# EAGLE design pressure (EAGLE 6.5.0)
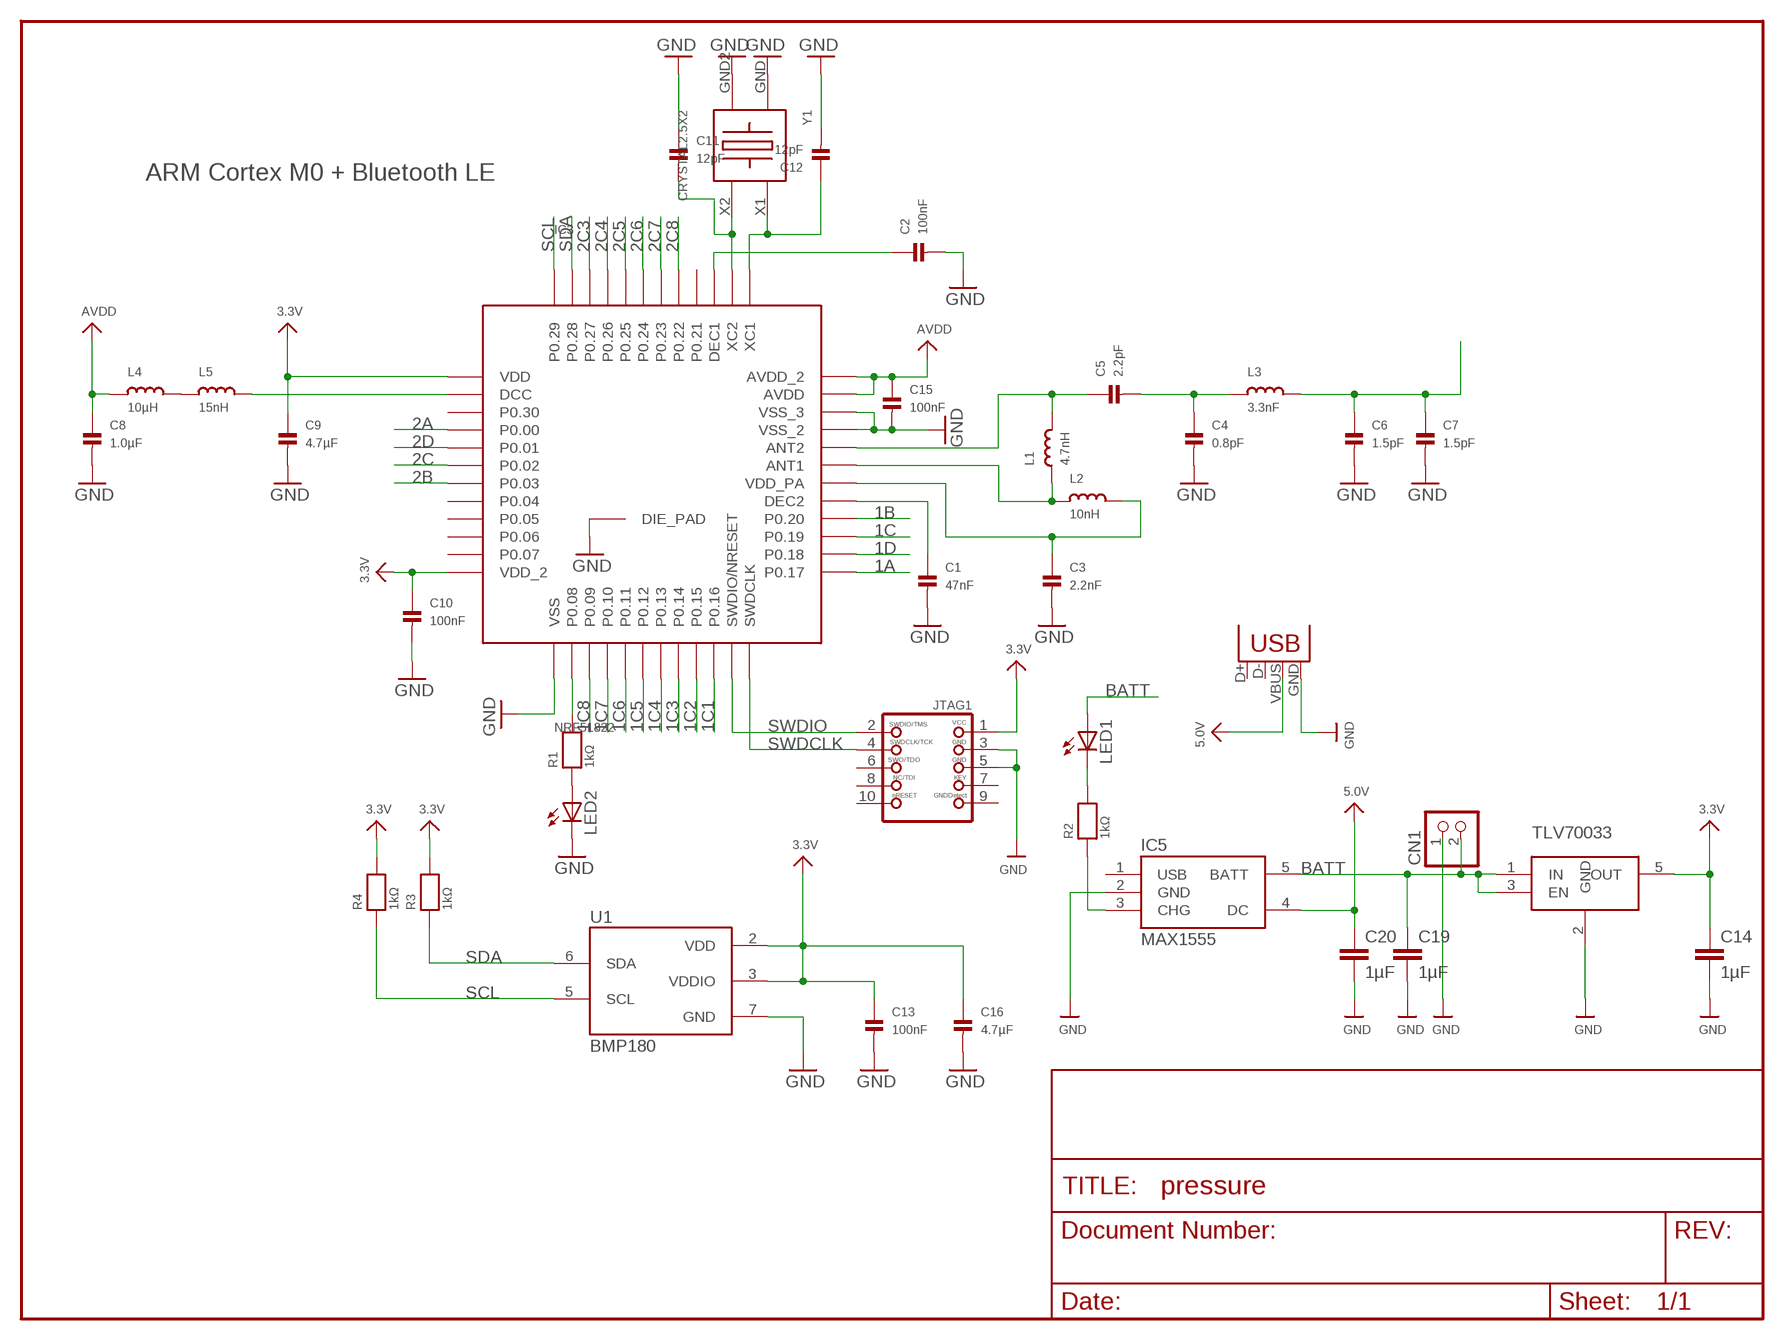
[diagram p0: schematic, sheet 1]

## Parts
C1  47nF  CAP_CERAMIC_0402  [_0402]
C2  100nF  CAP_CERAMIC_0402  [_0402]
C3  2.2nF  CAP_CERAMIC_0402  [_0402]
C4  0.8pF  CAP_CERAMIC_0402  [_0402]
C5  2.2pF  CAP_CERAMIC_0402  [_0402]
C6  1.5pF  CAP_CERAMIC_0402  [_0402]
C7  1.5pF  CAP_CERAMIC_0402  [_0402]
C8  1.0µF  CAP_CERAMIC_0402  [_0402]
C9  4.7µF  CAP_CERAMIC_0402  [_0402]
C10  100nF  CAP_CERAMIC_0402  [_0402]
C11  12pF  CAP_CERAMIC_0402  [_0402]
C12  12pF  CAP_CERAMIC_0402  [_0402]
C13  100nF  CAP_CERAMIC_0402  [_0402]
C14  1µF  C-EUC0603K  [C0603K]
C15  100nF  CAP_CERAMIC_0402  [_0402]
C16  4.7µF  CAP_CERAMIC_0402  [_0402]
C19  1µF  C-EUC0603K  [C0603K]
C20  1µF  C-EUC0603K  [C0603K]
CN1  JST_2PIN  [JSTPH2]
IC3  NRF51822  [QFN48]
IC4  TLV70033DCK  TLV700DCK  [SC70-5L]
IC5  MAX1555  [SOT23-5]
JTAG1  JTAG-CORTEXM3SMT  [2X05_1.27MM_SMT]
L1  4.7nH  INDUCTOR_0402  [_0402]
L2  10nH  INDUCTOR_0402  [_0402]
L3  3.3nF  INDUCTOR_0402  [_0402]
L4  10µH  INDUCTOR_0402  [_0402]
L5  15nH  INDUCTOR_0402  [_0402]
LED1  LEDCHIPLED_0603  [CHIPLED_0603]
LED2  LEDCHIPLED_0603  [CHIPLED_0603]
R1  1kΩ  RESISTOR_0402  [_0402]
R2  1kΩ  RESISTOR_0402  [_0402]
R3  1kΩ  RESISTOR_0402  [_0402]
R4  1kΩ  RESISTOR_0402  [_0402]
U1  BMP180  [BMP180]
X1  USB-MICROB  [USB-MICROB]
Y1  CRYSTAL2.5X2  [2.5X2MM]

## Nets
1A: IC3.25(P0.17)
1B: IC3.28(P0.20)
1C: IC3.27(P0.19)
1C1: IC3.22(P0.16)
1C2: IC3.21(P0.15)
1C3: IC3.20(P0.14)
1C4: IC3.19(P0.13)
1C5: IC3.18(P0.12)
1C6: IC3.17(P0.11)
1C7: IC3.16(P0.10)
1C8: IC3.15(P0.09)
1D: IC3.26(P0.18)
2A: IC3.4(P0.00)
2B: IC3.7(P0.03)
2C: IC3.6(P0.02)
2C3: IC3.46(P0.27)
2C4: IC3.45(P0.26)
2C5: IC3.44(P0.25)
2C6: IC3.43(P0.24)
2C7: IC3.42(P0.23)
2C8: IC3.41(P0.22)
2D: IC3.5(P0.01)
3.3V: C9.1 C10.1 C13.1 C14.1 C16.1 IC3.1(VDD) IC3.12(VDD_2) IC4.5(OUT) JTAG1.1 R3.2 R4.2 U1.2(VDD) U1.3(VDDIO)
5.0V: C20.1 IC5.4(DC) X1.VBUS
ANT: C6.1 C7.1 L3.2
ANT1: IC3.31(ANT1) L1.1 L2.1
ANT2: C5.1 IC3.32(ANT2) L1.2
AVDD: C8.1 C15.1 IC3.35(AVDD) IC3.36(AVDD_2) L4.1
BATT: C19.1 CN1.2 IC4.1(IN) IC4.3(EN) IC5.5(BATT) LED1.A
CHG: IC5.3(CHG) R2.1
DCC: IC3.2(DCC) L5.2
DEC1: C2.1 IC3.39(DEC1)
DEC2: C1.1 IC3.29(DEC2)
GND: C1.2 C2.2 C3.2 C4.2 C6.2 C7.2 C8.2 C9.2 C10.2 C11.1 C12.2 C13.2 C14.2 C15.2 C16.2 C19.2 C20.2 CN1.1 IC3.13(VSS) IC3.33(VSS_2) IC3.34(VSS_3) IC3.GND(DIE_PAD) IC4.2(GND) IC5.2(GND) JTAG1.3 JTAG1.5 LED2.C U1.7(GND) X1.GND Y1.GND Y1.GND2
LED: LED1.C R2.2
N$1: L4.2 L5.1
N$6: IC3.14(P0.08) R1.2
N$8: LED2.A R1.1
SCL: IC3.48(P0.29) R4.1 U1.5(SCL)
SDA: IC3.47(P0.28) R3.1 U1.6(SDA)
SWDCLK: IC3.24(SWDCLK) JTAG1.4
SWDIO: IC3.23(SWDIO/NRESET) JTAG1.2
UNBAL: C4.1 C5.2 L3.1
VDD_PA: C3.1 IC3.30(VDD_PA) L2.2
X1: C12.1 IC3.37(XC1) Y1.X1
X2: C11.2 IC3.38(XC2) Y1.X2
Unconnected: IC3.3(P0.30) IC3.8(P0.04) IC3.9(P0.05) IC3.10(P0.06) IC3.11(P0.07) IC3.40(P0.21) IC5.1(USB) JTAG1.6 JTAG1.7 JTAG1.8 JTAG1.9 JTAG1.10 X1.D+ X1.D-

## Notes on the sheet
- ARM Cortex M0 + Bluetooth LE
- TLV70033

## Library data of the parts
C1-C13 C15 C16 = microbuilder_v3:CAP_CERAMIC: Ceramic Capacitors 0402 - 0402 Surface Mount Capacitors 16pF 50V 5% [Digikey: 445-4899-2-ND] 18pF 50V 5% [Digikey: 490-1281-2-ND] 22pF 50V 5% [Digikey: 490-1283-2-ND] 68pF 50V 5% [Digikey: 490-1289-2-ND] 0.1uF 10V 10% [Digikey: 490-1318-2-ND] 1.0uF 6.3V 10% [Digikey: 490-1320-2-ND] 0603 - 0603 Surface Mount Capacitors 16 pF 50V 5% [Digikey: 445-5051-2-ND] 22 pF 50V [Digikey: PCC220ACVTR-ND] 33 pF 50V 5% [Digikey: 490-1415-1-ND] 56pF 50V 5% [Digikey: 490-1421-1-ND] 220pF 50V 5% [Digikey: 445-1285-1-ND] 680 pF 50V 2200 pF 50V 5% C0G [Digikey: 445-1297-1-ND] 5600 pF 100V 5% X7R [Digikey: 478-3711-1-ND] 0.1 µF 25V 10% [Digikey: PCC2277TR-ND] 0.22 µF 16V 10% X7R [Digikey: 445-1318-1-ND] 1.0 µF 25V 10% [Digikey: 445-5146-2-ND] 0603 - RF Specific 3pF 250V +/-0.1pF RF [Digikey: 712-1347-1-ND] 18 pF 250V 5% [Digikey: 478-3505-1-ND or 712-1322-1-ND] 56 pF 250V 5% C0G RF [Digikey: 490-4867-1-ND] 68 pF 250V RF [Digikey: 490-4868-1-ND] 0805 - 0805 Surface Mount Capacitors 220 pF 250V 2% RF Ceramic Capacitor [Digikey: 712-1398-1-ND] 1000 pF 50V 2% NP0 Ceramic Capacitor [Digikey: 478-3760-1-ND] 0.1 µF 25V 10% Ceramic Capacitor [Digikey: PCC1828TR-ND] 1.0 µF 16V 10% Ceramic Capacitor[Digikey: 490-1691-2-ND] 10.0 µF 10V 10% Ceramic Capacitor[Digikey: 709-1228-1-ND] 10.0 uF 16V 10% Ceramic Capacitor [Digikey: 478-5165-2-ND] 47 uF 6.3V 20% Ceramic Capacitor [Digikey: 587-1779-1-ND or 399-5506-1-ND] 1206 - 1206 Surface Mount Capacitors 47uF 10V 20% Ceramic Capacitor [Digikey: 490-5528-1-ND or 399-5508-1-ND or 445-6010-1-ND] 100uF 6.3V -20%, +80% Y5V Ceramic Capacitor (Digikey: 490-4512-1-ND, Mouser: 81-GRM31CF50J107ZE1L)
C14 C19 C20 = resistor:C-EU: CAPACITOR, European symbol
CN1 = microbuilder:JST_2PIN: JST 2-Pin Right-Angle Connector PH-Series - 4UConnector: 17311 SH-Series - 4UConnector: 07278
IC3 = NordicSemi:NRF51822: Bluetooth 4.0 Low Energy/2.4Ghz NORDIC SEMICONDUCTOR
IC4 = tlv700:TLV700
IC5 = SparkFun:MAX1555: MAX1555 Lithium Charger IC SOT-23 Lithium Polymer charging IC. Schematic element and footprint proven. Spark Fun Electronics SKU : COM-00674
JTAG1 = microbuilder_v3:JTAG-CORTEXM3: Serial Wire (SW-DP) Connector This standard 0.05" 10-pin connector is for use with the Cortex M0/M3's native SWD (serial wire debugger) interface (SW-DP). Some boards support a 20-pin combined JTAG+SWD connector (SWJ-DP), such as the LPC1700 family, but many smaller devices only work with SWD which typically use the smaller 10-pin SW-DP connecter (the LPC1300 family, for example, only supports SWD). 2x05 1.27mm/0.05" Connector: This is the standard SMT connector defined by ARM for all Cortex devices, and should be used in most situations and for forward-compatibility since any new devices coming to market will likely use this connector. MOLEX 10 Pin 0.1" Connector: This 0.1" 10 pin connector has the same pin layout as the standard 0.05" connector, but is easier to work with if you are using standard jumper wires or custom cables to connect your SWD hardware. MOLEX 20 Pin 0.1" Connector: This 0.1" 20 pin connector is the same model used for ARM7/ARM9 JTAG debuggers, but is connected to match the pins on the Segger J-Link for ARM (which supports both JTAG and SWD debugging). See the following document from ARM for more information on Cortex M3 Debug Connectors: http://infocenter.arm.com/help/topic/com.arm.doc.faqs/attached/13634/cortex_debug_connectors.pdf And the following page for an overview with images of the different connector types: http://www.keil.com/peripherals/coresight/connectors.asp
L1-L5 = microbuilder_v3:INDUCTOR: Inductors 0603: 10nH Ceramic Inductor - microwire antenna/RF (Digikey: 712-1434-2-ND) 0805: 560nH Ceramic Inductor - RF (Digikey: 553-1047-1-ND) 270nH Ceramic Inductor - Q = 40@250MHz, +-5%, 1 Ohm DC Resistance (Digikey: 535-10506-2-ND) 1007 (2518 Metric) SMT: 10µH 10% 250mOhm 820mA 1007 Inductor (Digikey: 587-2189-1-ND) 22µH 10% 500mOhm 580mA 1007 Inductor (Digikey: 587-2190-1-ND) 47µH 10% 950mOhm 420mA 1007 Inductor (Digikey: 587-2191-1-ND) 47µH 5% 100mOhm 1A 1008 Inductor (Digikey: 732-1816-1-ND) 5.0x5.0mm (Taiyo Yuden NR5040 Series) 6.8µH 20% 2.3A 64mOhm Inductor (Digikey: 587-2374-2-ND) 5.0x5.0mm (TDK VLC5045 Series) 4.7µH 20% 3.3A 34mOhm Inductor (Digikey: 445-6526-1-ND) 6.8µH 20% 2.7A 46mOhm Inductor (Digikey: 445-6527-1-ND) 6.0x6.0mm (TDK VLC6045 Series) 4.7µH 20% 3.8A 27mOhm Inductor (Digikey: 445-6538-2-ND) 6.8µH 20% 3A 41mOhm Inductor (Digikey: 445-6540-1-ND) 6.2µH 30% 2.2A 45mOhm Inductor (Digikey: SRR5028-6R2YCT-ND) - Not TDK VLC6045 but footprint should match 6.0x6.0mm (TDK SLF6045 Series) 6.8uH 30% 2A 33mOhm Inductor (Digikey: 445-4572-1-ND, Mouser: 810-SLF645T6R8N2R0PF)
LED1 LED2 = led:LED: LED OSRAM: - CHIPLED LG R971, LG N971, LY N971, LG Q971, LY Q971, LO R971, LY R971 LH N974, LH R974 LS Q976, LO Q976, LY Q976 LO Q996 - Hyper CHIPLED LW Q18S LB Q993, LB Q99A, LB R99A - SideLED LS A670, LO A670, LY A670, LG A670, LP A670 LB A673, LV A673, LT A673, LW A673 LH A674 LY A675 LS A676, LA A676, LO A676, LY A676, LW A676 LS A679, LY A679, LG A679 - Hyper Micro SIDELED® LS Y876, LA Y876, LO Y876, LY Y876 LT Y87S - SmartLED LW L88C, LW L88S LB L89C, LB L89S, LG L890 LS L89K, LO L89K, LY L89K LS L896, LA L896, LO L896, LY L896 - TOPLED LS T670, LO T670, LY T670, LG T670, LP T670 LSG T670, LSP T670, LSY T670, LOP T670, LYG T670 LG T671, LOG T671, LSG T671 LB T673, LV T673, LT T673, LW T673 LH T674 LS T676, LA T676, LO T676, LY T676, LB T676, LH T676, LSB T676, LW T676 LB T67C, LV T67C, LT T67C, LS T67K, LO T67K, LY T67K, LW E67C LS E67B, LA E67B, LO E67B, LY E67B, LB E67C, LV E67C, LT E67C LW T67C LS T679, LY T679, LG T679 LS T770, LO T770, LY T770, LG T770, LP T770 LB T773, LV T773, LT T773, LW T773 LH T774 LS E675, LA E675, LY E675, LS T675 LS T776, LA T776, LO T776, LY T776, LB T776 LHGB T686 LT T68C, LB T68C - Hyper Mini TOPLED® LB M676 - Mini TOPLED Santana® LG M470 LS M47K, LO M47K, LY M47K Source: http://www.osram.convergy.de LUXEON: - LUMILED® LXK2-PW12-R00, LXK2-PW12-S00, LXK2-PW14-U00, LXK2-PW14-V00 LXK2-PM12-R00, LXK2-PM12-S00, LXK2-PM14-U00 LXK2-PE12-Q00, LXK2-PE12-R00, LXK2-PE12-S00, LXK2-PE14-T00, LXK2-PE14-U00 LXK2-PB12-K00, LXK2-PB12-L00, LXK2-PB12-M00, LXK2-PB14-N00, LXK2-PB14-P00, LXK2-PB14-Q00 LXK2-PR12-L00, LXK2-PR12-M00, LXK2-PR14-Q00, LXK2-PR14-R00 LXK2-PD12-Q00, LXK2-PD12-R00, LXK2-PD12-S00 LXK2-PH12-R00, LXK2-PH12-S00 LXK2-PL12-P00, LXK2-PL12-Q00, LXK2-PL12-R00 Source: www.luxeon.com KINGBRIGHT: KA-3528ASYC Source: www.kingbright.com
R1-R4 = microbuilder_v3:RESISTOR: Resistors 0402 - 0402 Surface Mount Package 22 Ohm 1% 1/16W [Digikey: 311-22.0LRTR-ND] 33 Ohm 5% 1/16W 1.0K 5% 1/16W 1.5K 5% 1/16W 2.0K 1% 1/16W 10.0K 1% 1/16W [Digikey: 311-10.0KLRTR-ND] 10.0K 5% 1/16W [Digikey: RMCF0402JT10K0TR-ND] 12.1K 1% 1/16W [Digikey: 311-22.0LRTR-ND] 100.0K 5% 1/16W 0603 - 0603 Surface Mount Package 0 Ohm 1/10 Watt 1% Resistor 15 Ohm 1/10 Watt 1% Resistor 33 Ohm 1/10 Watt 1% Resistor 49.9 Ohm 1/10 Watt 1% Resistor 100 Ohm 1/10 Watt 1% Resistor 150 Ohm 1/10 Watt 1% Resistor 240 Ohm 1/10 Watt 1% Resistor 390 Ohm 1/10 Watt 1% Resistor 560 Ohm 1/10 Watt 1% Resistor 680 Ohm 1/10 Watt 1% Resistor 750 Ohm 1/10 Watt 1% Resistor 1.0K Ohm 1/10 Watt 1% Resistor 1.5K Ohm 1/10 Watt 1% Resistor 2.0K Ohm 1/10 Watt 1% Resistor 2.2K Ohm 1/10 Watt 1% Resistor 3.3K Ohm 1/10 Watt 1% Resistor 4.7K Ohm 1/10 Watt 1% Resistor 10.0K Ohm 1/10 Watt 1% Resistor 12.0K Ohm 1/10 Watt 1% Resistor 12.1K Ohm 1/10 Watt 1% Resistor 20.0K Ohm 1/10 Watt 1% Resistor 33.0K Ohm 1/10 Watt 1% Resistor 100.0K Ohm 1/10 Watt 1% Resistor 0805 - 0805 Surface Mount Package 0 Ohm 1/8 Watt 1% Resistor 33 Ohm 1/8 Watt 1% Resistor 100 Ohm 1/8 Watt 1% Resistor 150 Ohm 1/8 Watt 1% Resistor 200 Ohm 1/8 Watt 1% Resistor 240 Ohm 1/8 Watt 1% Resistor 330 Ohm 1/8 Watt 1% Resistor 390 Ohm 1/8 Watt 1% Resistor 470 Ohm 1/8 Watt 1% Resistor 1.0K Ohm 1/8 Watt 1% Resistor 1.5K Ohm 1/8 Watt 1% Resistor 2.0K Ohm 1/8 Watt 1% Resistor 4.7K Ohm 1/8 Watt 1% Resistor 5.1K Ohm 1/8 Watt 1% Resistor 5.6K Ohm 1/8 Watt 1% Resistor 10.0K Ohm 1/8 Watt 1% Resistor 22.0K Ohm 1/8 Watt 1% Resistor 33.0K Ohm 1/8 Watt 1% Resistor 100K Ohm 1/8 Watt 1% Resistor 1206 - 1206 Surface Mount Package 2012 - 2010 Surface Mount Package 0.11 Ohm 1/2 Watt 1% Resistor - Digikey: RHM.11UCT-ND
U1 = SparkFun-Sensors:BMP180: BOSCH BMP180 DIGITAL BAROMETRIC PRESSURE SENSOR Web page: http://www.bosch-sensortec.com/en/homepage/products_3/environmental_sensors_1/bmp180_1/bmp180 Datasheet: http://ae-bst.resource.bosch.com/media/products/dokumente/bmp180/BST-BMP180-DS000-09.pdf The BMP180 is the function compatible successor of the BMP085, a new generation of high precision digital pressure sensors for consumer applications. The ultra-low power, low voltage electronics of the BMP180 is optimized for use in mobile phones, PDAs, GPS navigation devices and outdoor equipment. With a low altitude noise of merely 0.25m at fast conversion time, the BMP180 offers superior performance. The I2C interface allows for easy system integration with a microcontroller. The BMP180 is based on piezo-resistive technology for EMC robustness, high accuracy and linearity as well as long term stability. Key features: - Temperature measurement included - I2C interface - Fully calibrated - Pb-free, halogen-free and RoHS compliant, - MSL 1 Basic specs: Pressure range: 300 to 1100hPa (+9000m to -500m relating to sea level) Supply voltage: 1.8 to 3.6V (VDD), 1.62V to 3.6V (VDDIO) Package: LGA package with metal lid Small footprint: 3.6mm x 3.8mm Super-flat: 0.93mm height Low power: 5μA at 1 sample / sec. in standard mode Low noise: 0.06hPa (0.5m) in ultra low power mode, 0.02hPa (0.17m) advanced resolution mode Typical applications: - Enhancement of GPS navigation (dead-reckoning, slope detection, etc.) - In- and out-door navigation - Leisure and sports - Weather forecast - Vertical velocity indication (rise/sink speed)
X1 = SparkFun:USB: USB Connectors USB-B-PTH is fully proven SKU : PRT-00139 USB-miniB is fully proven SKU : PRT-00587 USB-A-PCB is untested. USB-A-H is throughly reviewed, but untested. Spark Fun Electronics SKU : PRT-00437 USB-B-SMT is throughly reviewed, but untested. Needs silkscreen touching up. USB-A-S has not been used/tested USB-MB-H has not been used/tested
Y1 = NordicSemi:CRYSTAL2.5X2: Crystal 16.00MHz 8pF SMD Size Dimension: 2.5mm x 2.00mm Package: 4-SMD

## Board
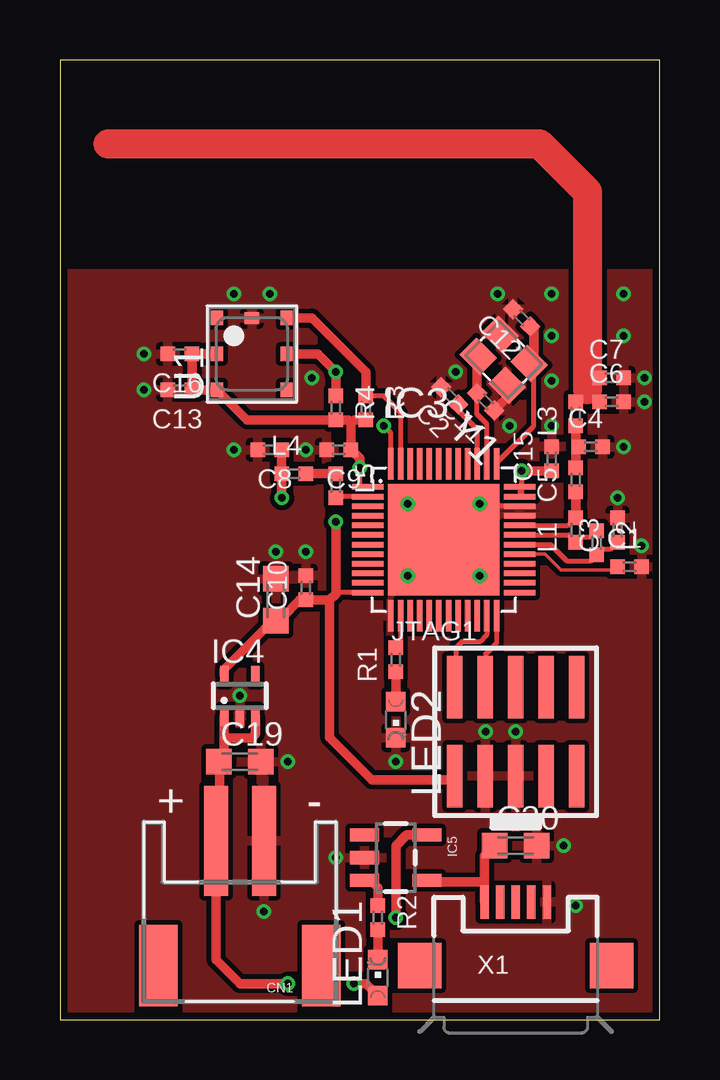
[diagram p1: board, top side]
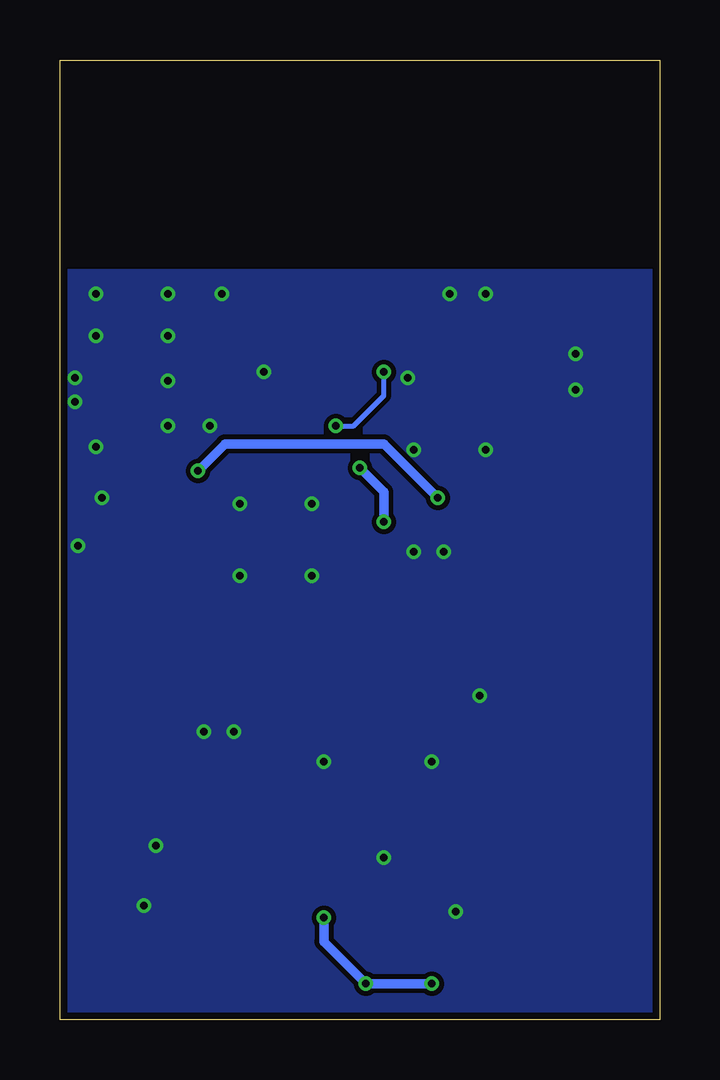
[diagram p2: board, bottom side, seen from below]

Size 25 x 40 mm. Coordinates in mm from the lower left corner, seen from the top.
Outline: 0,0 25,0 25,40 0,40 0,0
Copper layers (1*16): Top 0.035mm / dielectric 1.5mm / Bottom 0.035mm
Design rules "PCB-POOL Standard": minimum track width 0.15mm, minimum drill 0.3mm, track to track 0.15mm, track to pad 0.15mm, pad to pad 0.15mm, via to via 0.15mm, smd to smd 0.15mm, copper to edge 0.3mm, drill to drill 0.2mm, minimum pad ring 0.2mm, minimum via ring 0.15mm, stop-mask expansion 0.075mm, vias tented up to drill 0mil, thermal gap 0.2mm
tRestrict: area 0.5,31.5 to 24.5,39.5
bRestrict: area 0.5,31.5 to 24.5,39.5

### Footprints (pad centres in the part's own frame; a part is rotated, then mirrored left to right if it is on the bottom)
_0402 = smd 0.6 x 0.6: 1 -0.508,0; 2 0.508,0
C0603K = smd 1.05 x 1.08: 1 -0.875,0; 2 0.875,0
JSTPH2 = smd 1 x 4.6: 1 -1,-3.7; 2 1,-3.7 | smd 1.6 x 3.4: NC1 -3.4,1.5; NC2 3.4,1.5
QFN48 = smd 1.3 x 0.226: 1 -3.17,2.2; 2 -3.17,1.8; 3 -3.17,1.4; 4 -3.17,1; 5 -3.17,0.6; 6 -3.17,0.2; 7 -3.17,-0.2; 8 -3.17,-0.6; 9 -3.17,-1; 10 -3.17,-1.4; 11 -3.17,-1.8; 12 -3.17,-2.2; 25 3.17,-2.2; 26 3.17,-1.8; 27 3.17,-1.4; 28 3.17,-1; 29 3.17,-0.6; 30 3.17,-0.2; 31 3.17,0.2; 32 3.17,0.6; 33 3.17,1; 34 3.17,1.4; 35 3.17,1.8; 36 3.17,2.2 | smd 0.226 x 1.3: 13 -2.2,-3.17; 14 -1.8,-3.17; 15 -1.4,-3.17; 16 -1,-3.17; 17 -0.6,-3.17; 18 -0.2,-3.17; 19 0.2,-3.17; 20 0.6,-3.17; 21 1,-3.17; 22 1.4,-3.17; 23 1.8,-3.17; 24 2.2,-3.17; 37 2.2,3.17; 38 1.8,3.17; 39 1.4,3.17; 40 1,3.17; 41 0.6,3.17; 42 0.2,3.17; 43 -0.2,3.17; 44 -0.6,3.17; 45 -1,3.17; 46 -1.4,3.17; 47 -1.8,3.17; 48 -2.2,3.17 | smd 4.66 x 4.66: GND 0,0
SC70-5L = smd 0.35 x 0.8: 1 -0.65,-0.85; 2 0,-0.85; 3 0.65,-0.85; 4 0.65,0.85; 5 -0.65,0.85
SOT23-5 = smd 0.55 x 1.2: 1 -0.95,-1.3; 2 0,-1.3; 3 0.95,-1.3; 4 0.95,1.3; 5 -0.95,1.3
2X05_1.27MM_SMT = smd 0.65 x 2.6: 1 -2.54,-1.85; 2 -2.54,1.85; 3 -1.27,-1.85; 4 -1.27,1.85; 5 0,-1.85; 6 0,1.85; 7 1.27,-1.85; 8 1.27,1.85; 9 2.54,-1.85; 10 2.54,1.85
CHIPLED_0603 = smd 0.8 x 0.8: A 0,-0.75; C 0,0.75
BMP180 = smd 0.6 x 0.5: 1 1.5,1.45; 2 0,1.45; 3 -1.5,1.45; 4 -1.5,-1.45; 5 0,-1.45; 6 1.5,-1.45 | smd 0.5 x 0.6: 7 1.5,0
USB-MICROB = smd 0.35 x 1.4: D+ 0,2.65; D- -0.65,2.65; GND 1.3,2.65; ID 0.65,2.65; VBUS -1.3,2.65 | smd 1.8 x 1.9: MT1 -4,0; MT2 4,0
2.5X2MM = smd 1.2 x 1: GND 0.85,-0.65; GND2 -0.85,0.65; X1 -0.85,-0.65; X2 0.85,0.65

### Placement (x,y rotation side)
C1  23.75,18.88 0 top
C2  16.25,26 135 top
C3  23.25,20.41 90 top
C4  22.12,23.88 0 top
C5  21.5,22.5 90 top
C6  23,25.75 0 top
C7  23,26.75 0 top
C8  8.75,23.75 180 top
C9  11.62,23.75 180 top
C10  10.25,18 90 top
C11  17.75,25.75 135 top
C12  19.25,29.25 135 top
C13  5,26.25 180 top
C14  9,17.5 90 top
C15  20.5,23.38 90 top
C16  5,27.75 180 top
C19  7.5,10.75 0 top
C20  19,7.25 0 top
CN1  7.5,3.75 180 top
IC3  16,20 0 top
IC4  7.5,13.5 0 top
IC5  14,6.75 270 top
JTAG1  19,12 0 top
L1  21.5,20.41 90 top
L2  22.38,19.88 270 top
L3  21.5,25.25 90 top
L4  9.75,22.75 0 top
L5  11.5,22.25 270 top
LED1  13.25,1.75 0 top
LED2  14,12.5 180 top
R1  14,15 90 top
R2  13.25,4.25 270 top
R3  12.75,25.5 270 top
R4  11.5,25.5 270 top
U1  8,27.75 90 top
X1  19,2.25 0 top
Y1  18.5,27.5 135 top

### Tracks (layer width: path | path; a pad name or v marks a point on that pad's centre or on a via)
3.3V  (via drill 0.3)
  Top 0.2: IC3.1 12.5,22.2 v12.5,23 | IC3.12 11.55,17.8 11.5,17.75
  Top 0.4: 8.6,16.27 C14.1 | v12.5,23 12.5,23.38 C9.1 12.13,24.88 | 11.24,17.49 C10.1 9.99,17.49 9.25,16.75 9.35,16.65 8.6,16.27 | 11.24,17.49 11.5,17.75 v11.5,20.75 | 8.6,16.27 8.53,16.27 6.85,14.6 IC4.5 | JTAG1.1 16.31,10 13,10 11.24,11.76 11.24,17.49 | U1.2 C16.1 C13.1 U1.3 7.81,24.99 R4.2 12.02,24.99 12.13,24.88 | 12.13,24.88 12.25,25 R3.2
  Bottom 0.4: v11.5,20.75 11.5,22 v12.5,23
5.0V
  Top 0.4: C20.1 17.7,6.83 17.7,5.75 | 17.7,5.75 X1.VBUS | IC5.4 15.35,5.75 17.7,5.75
ANT
  Top 0.2: C7.1 22.25,26.75 22,26.5 | C6.1 22,26.25 L3.2
  Top 1.2: 22,26.25 22,26.5 22,34.5 20,36.5 2,36.5
ANT1
  Top 0.2: IC3.31 21.2,20.2 L1.1 21.73,20.12 22.12,20.12 L2.1
ANT2
  Top 0.2: IC3.32 21.19,20.6 L1.2
  Top 0.4: L1.2 C5.1
AVDD  (via drill 0.3)
  Top 0.2: v19.25,22.88 19.25,21.8 IC3.35 IC3.36
  Top 0.4: C8.1 9.24,23.5 L4.1 v9.24,21.75 v9.25,21.75 | C15.1 19.25,22.87 v19.25,22.88
  Bottom 0.4: v9.25,21.75 11.5,24 18.12,24 v19.25,22.88
BATT  (via drill 0.3)
  Top 0.4: IC5.5 14.45,7.7 14,7.25 v14,4.25 | v9.5,1.5 7.5,1.5 6.5,2.5 CN1.2 6.65,7.6 6.65,10.78 | C19.1 6.65,10.78 | v12.25,1.5 12.75,1.5 LED1.A | 6.65,10.78 6.85,10.97 6.85,11.5 | 6.85,11.5 IC4.1 | IC4.3 8.15,11.9 8,11.75 7.1,11.75 6.85,11.5
  Bottom 0.4: v14,4.25 14,3.25 v12.25,1.5 v9.5,1.5
CHG
  Top 0.4: R2.1 13.25,5.5 12.95,5.8 IC5.3
DCC
  Top 0.2: IC3.2 11.56,21.8 L5.2
DEC1
  Top 0.2: IC3.39 17.4,24.6 16.61,25.39 C2.1
DEC2
  Top 0.15: IC3.29 20.23,19.4 20.88,18.75 23.25,18.75 C1.1
GND  (via drill 0.3)
  Top 0.2: IC3.34 17.5,21.4 v17.5,21.5
  Top 0.4: C11.1 18.64,25.92 Y1.GND2 | 17.5,21.4 17.4,21.4 IC3.GND
  other vias: 14.5,21.5 17.5,18.5 14.5,18.5 23.25,21.75 24.25,19.75 23.5,23.88 24.38,25.75 24.38,26.75 20.5,26.62 20.5,28.5 20.5,30.25 23.5,30.25 23.5,28.5 18.75,24.75 16.5,27 18.25,30.25 20.5,24.75 10.25,23.75 7.25,23.75 8.5,4.5 21.5,4.75 11.5,6.75 21,7.25 14,10.75 7.5,13.5 10.25,19.5 8.75,30.25 3.5,27.75 3.5,26.25 9,19.5 10.5,26.75 7.25,30.25 17.75,12 19,12 9.5,10.75
  pour Top (isolate 0.2): 0,40 25,40 25,0 0,0
  pour Bottom (isolate 0.2): 0,40 25,40 25,0 0,0
LED
  Top 0.4: LED1.C R2.2
N$1
  Top 0.4: L5.1 10.51,22.76 L4.2
N$6
  Top 0.2: IC3.14 14.2,15.71 R1.2
N$8
  Top 0.4: R1.1 LED2.A
SCL  (via drill 0.3)
  Top 0.2: IC3.48 13.8,24.45 v13.5,24.75
  Top 0.4: U1.5 10.75,27.75 v11.5,27 R4.1
  Bottom 0.2: v13.5,24.75 12.76,24.75 R4.1 v11.5,27
SDA
  Top 0.15: R3.1
  Top 0.2: R3.1 13.49,26.01 14.2,25.3 IC3.47
  Top 0.4: U1.6 10.5,29.25 12.75,27 R3.1
SWDCLK
  Top 0.2: IC3.24 18.2,15.7 17.75,15.25 17.75,13.87 JTAG1.4
SWDIO
  Top 0.2: IC3.23 17.8,16.05 17.5,15.75 16.75,15.75 16.5,15.5 16.5,13.89 JTAG1.2
UNBAL
  Top 0.4: C5.2 21.5,23.88 | 21.5,23.88 L3.1 | C4.1 21.5,23.88
VDD_PA
  Top 0.2: IC3.30 20.45,19.8 21.12,19.12 22.13,19.12 L2.2 22.63,19.62 22.98,19.62 C3.1
X1
  Top 0.2: IC3.37 18.2,23.2 19.75,24.75 19.75,27.17 Y1.X1
  Top 0.4: Y1.X1 19.75,27.55 19.75,28.75 C12.1
X2
  Top 0.2: IC3.38 17.8,24.82 17.39,25.23 C11.2
  Top 0.4: C11.2 17.39,27.59 Y1.X2

### Text on the board
tStop: BMP180